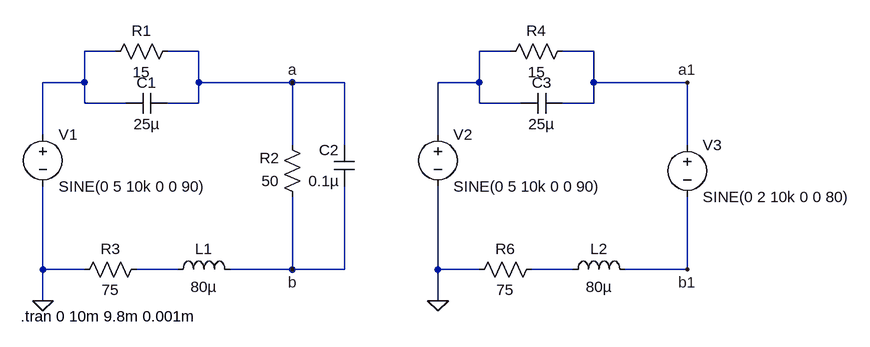
[diagram p0: schematic RTR806_Class_14_20231102_Investigation_of_compensation.asc]
RTR806_Class_14_20231102_Investigation_of_compensation.asc, the LTspice schematic file:
Version 4
SHEET 1 2148 680
WIRE 112 -32 64 -32
WIRE 240 -32 192 -32
WIRE 720 -32 672 -32
WIRE 848 -32 800 -32
WIRE 64 16 64 -32
WIRE 64 16 0 16
WIRE 240 16 240 -32
WIRE 384 16 240 16
WIRE 464 16 384 16
WIRE 672 16 672 -32
WIRE 672 16 608 16
WIRE 848 16 848 -32
WIRE 992 16 848 16
WIRE 64 48 64 16
WIRE 128 48 64 48
WIRE 240 48 240 16
WIRE 240 48 192 48
WIRE 672 48 672 16
WIRE 736 48 672 48
WIRE 848 48 848 16
WIRE 848 48 800 48
WIRE 0 96 0 16
WIRE 608 96 608 16
WIRE 384 112 384 16
WIRE 464 112 464 16
WIRE 992 112 992 16
WIRE 0 304 0 176
WIRE 64 304 0 304
WIRE 208 304 144 304
WIRE 384 304 384 192
WIRE 384 304 288 304
WIRE 464 304 464 176
WIRE 464 304 384 304
WIRE 608 304 608 176
WIRE 672 304 608 304
WIRE 816 304 752 304
WIRE 992 304 992 192
WIRE 992 304 896 304
WIRE 0 352 0 304
WIRE 608 352 608 304
FLAG 0 352 0
FLAG 384 16 a
FLAG 384 304 b
FLAG 608 352 0
FLAG 992 16 a1
FLAG 992 304 b1
SYMBOL voltage 0 80 R0
WINDOW 123 0 0 Left 0
WINDOW 39 0 0 Left 0
SYMATTR InstName V1
SYMATTR Value SINE(0 5 10k 0 0 90)
SYMBOL res 208 -48 R90
WINDOW 0 0 56 VBottom 2
WINDOW 3 32 56 VTop 2
SYMATTR InstName R1
SYMATTR Value 15
SYMBOL res 400 208 R180
WINDOW 0 36 76 Left 2
WINDOW 3 36 40 Left 2
SYMATTR InstName R2
SYMATTR Value 50
SYMBOL res 48 320 R270
WINDOW 0 32 56 VTop 2
WINDOW 3 0 56 VBottom 2
SYMATTR InstName R3
SYMATTR Value 75
SYMBOL ind 192 320 R270
WINDOW 0 32 56 VTop 2
WINDOW 3 5 56 VBottom 2
SYMATTR InstName L1
SYMATTR Value 80µ
SYMBOL cap 192 32 R90
WINDOW 0 0 32 VBottom 2
WINDOW 3 32 32 VTop 2
SYMATTR InstName C1
SYMATTR Value 25µ
SYMBOL cap 480 176 R180
WINDOW 0 24 56 Left 2
WINDOW 3 24 8 Left 2
SYMATTR InstName C2
SYMATTR Value 0.1µ
SYMBOL voltage 608 80 R0
WINDOW 123 0 0 Left 0
WINDOW 39 0 0 Left 0
SYMATTR InstName V2
SYMATTR Value SINE(0 5 10k 0 0 90)
SYMBOL res 816 -48 R90
WINDOW 0 0 56 VBottom 2
WINDOW 3 32 56 VTop 2
SYMATTR InstName R4
SYMATTR Value 15
SYMBOL res 656 320 R270
WINDOW 0 32 56 VTop 2
WINDOW 3 0 56 VBottom 2
SYMATTR InstName R6
SYMATTR Value 75
SYMBOL ind 800 320 R270
WINDOW 0 32 56 VTop 2
WINDOW 3 5 56 VBottom 2
SYMATTR InstName L2
SYMATTR Value 80µ
SYMBOL cap 800 32 R90
WINDOW 0 0 32 VBottom 2
WINDOW 3 32 32 VTop 2
SYMATTR InstName C3
SYMATTR Value 25µ
SYMBOL voltage 992 96 R0
WINDOW 123 0 0 Left 0
WINDOW 39 0 0 Left 0
SYMATTR InstName V3
SYMATTR Value SINE(0 2 10k 0 0 80)
TEXT -34 376 Left 2 !.tran 0 10m 9.8m 0.001m

The netlist it stands for:
* RTR806_Class_14_20231102_Investigation_of_compensation.asc
V1 N001 0 SINE(0 5 10k 0 0 90)
R1 a N001 15
R2 b a 50
R3 0 N003 75
L1 N003 b 80µ
C1 a N001 25µ
C2 b a 0.1µ
V2 N002 0 SINE(0 5 10k 0 0 90)
R4 a1 N002 15
R6 0 N004 75
L2 N004 b1 80µ
C3 a1 N002 25µ
V3 a1 b1 SINE(0 2 10k 0 0 80)
.tran 0 10m 9.8m 0.001m
.backanno
.end